# EAGLE design Daughter Board_2.1 (EAGLE 9.6.2)
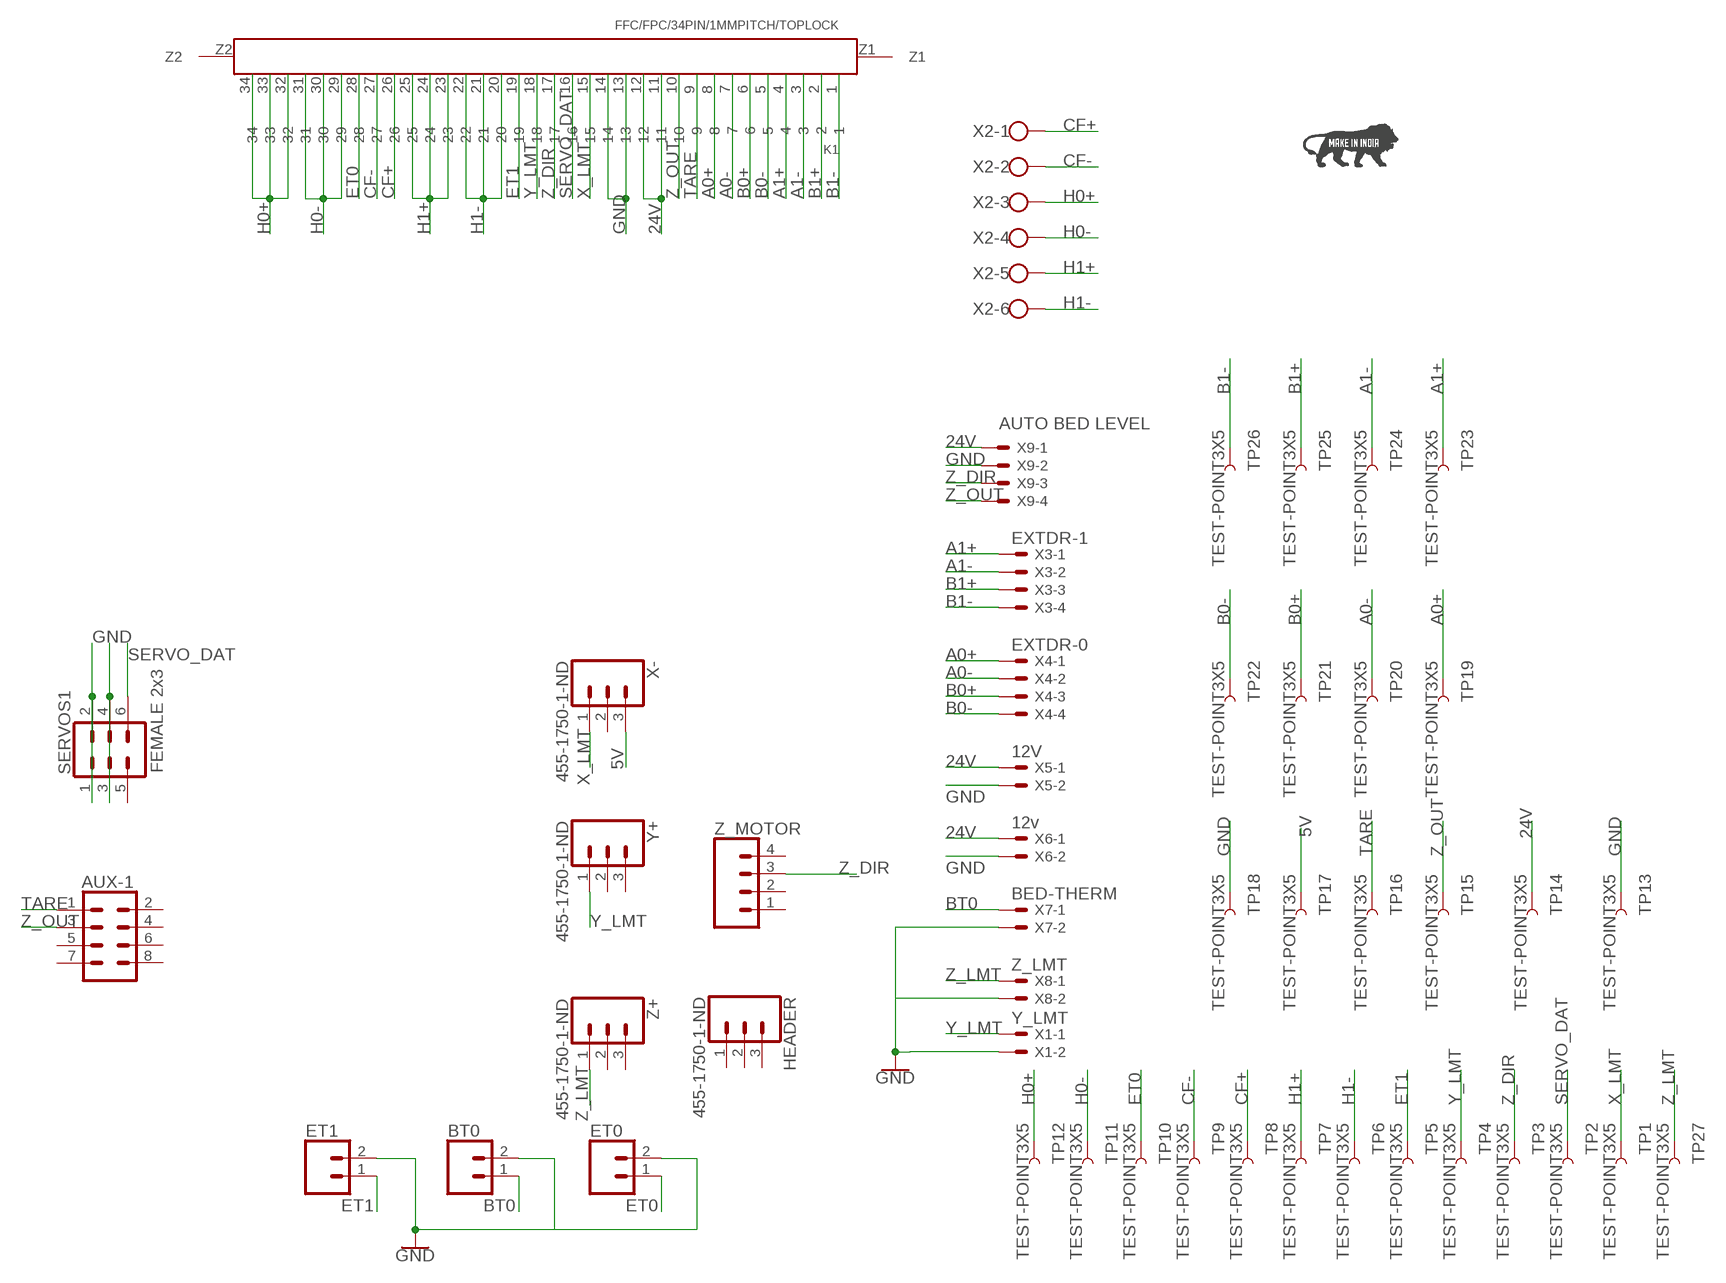
[diagram p0: schematic, sheet 1]

## Parts
AUX-1  CONN_04X2  [2X4]
BT0  CONN_02  [1X02]
ET0  CONN_02  [1X02]
ET1  CONN_02  [1X02]
HEADER  455-1750-1-ND  CONN_03  [1X03]
K1  FFC/FPC/34PIN/1MMPITCH/TOPLOCK  [34PIN/1MMPITCH/FFC/FPC]
SERVOS1  FEMALE 2x3  CONN_03X2FEMALE  [2X3]
TP1  TEST-POINT3X5  [PAD.03X.05]
TP2  TEST-POINT3X5  [PAD.03X.05]
TP3  TEST-POINT3X5  [PAD.03X.05]
TP4  TEST-POINT3X5  [PAD.03X.05]
TP5  TEST-POINT3X5  [PAD.03X.05]
TP6  TEST-POINT3X5  [PAD.03X.05]
TP7  TEST-POINT3X5  [PAD.03X.05]
TP8  TEST-POINT3X5  [PAD.03X.05]
TP9  TEST-POINT3X5  [PAD.03X.05]
TP10  TEST-POINT3X5  [PAD.03X.05]
TP11  TEST-POINT3X5  [PAD.03X.05]
TP12  TEST-POINT3X5  [PAD.03X.05]
TP13  TEST-POINT3X5  [PAD.03X.05]
TP14  TEST-POINT3X5  [PAD.03X.05]
TP15  TEST-POINT3X5  [PAD.03X.05]
TP16  TEST-POINT3X5  [PAD.03X.05]
TP17  TEST-POINT3X5  [PAD.03X.05]
TP18  TEST-POINT3X5  [PAD.03X.05]
TP19  TEST-POINT3X5  [PAD.03X.05]
TP20  TEST-POINT3X5  [PAD.03X.05]
TP21  TEST-POINT3X5  [PAD.03X.05]
TP22  TEST-POINT3X5  [PAD.03X.05]
TP23  TEST-POINT3X5  [PAD.03X.05]
TP24  TEST-POINT3X5  [PAD.03X.05]
TP25  TEST-POINT3X5  [PAD.03X.05]
TP26  TEST-POINT3X5  [PAD.03X.05]
TP27  TEST-POINT3X5  [PAD.03X.05]
U$2  MAKEININDIA  [MAKEININDIA]
X1  Y_LMT  JST-XH-02-PIN-LONG-PAD  [JST-XH-02-PACKAGE-LONG-PAD]
X2  W237-6  [W237-6]
X3  EXTDR-1  JST-XH-04-PIN-LONG-PAD  [JST-XH-04-PACKAGE-LONG-PAD]
X4  EXTDR-0  JST-XH-04-PIN-LONG-PAD  [JST-XH-04-PACKAGE-LONG-PAD]
X5  12V  JST-XH-02-PIN-LONG-PAD  [JST-XH-02-PACKAGE-LONG-PAD]
X6  12v  JST-XH-02-PIN-LONG-PAD  [JST-XH-02-PACKAGE-LONG-PAD]
X7  BED-THERM  JST-XH-02-PIN-LONG-PAD  [JST-XH-02-PACKAGE-LONG-PAD]
X8  Z_LMT  JST-XH-02-PIN-LONG-PAD  [JST-XH-02-PACKAGE-LONG-PAD]
X9  JST-XH-04-PIN-LONG-PAD  [JST-XH-04-PACKAGE-LONG-PAD]
X-  455-1750-1-ND  CONN_03  [1X03]
Y+  455-1750-1-ND  CONN_03  [1X03]
Z+  455-1750-1-ND  CONN_03  [1X03]
Z_MOTOR  CONN_04  [1X04]

## Nets
5V: TP17.P$1 X-.3
24V: K1.11 K1.12 TP14.P$1 X5.1 X6.1 X9.1
A0+: K1.8 TP19.P$1 X4.1
A0-: K1.7 TP20.P$1 X4.2
A1+: K1.4 TP23.P$1 X3.1
A1-: K1.3 TP24.P$1 X3.2
B0+: K1.6 TP21.P$1 X4.3
B0-: K1.5 TP22.P$1 X4.4
B1+: K1.2 TP25.P$1 X3.3
B1-: K1.1 TP26.P$1 X3.4
BT0: BT0.1 X7.1
CF+: K1.26 TP8.P$1 X2.1
CF-: K1.27 TP9.P$1 X2.2
ET0: ET0.1 K1.28 TP10.P$1
ET1: ET1.1 K1.19 TP5.P$1
GND: BT0.2 ET0.2 ET1.2 K1.13 K1.14 SERVOS1.1 SERVOS1.2 TP13.P$1 TP18.P$1 X1.2 X5.2 X6.2 X7.2 X8.2 X9.2
H0+: K1.32 K1.33 K1.34 TP12.P$1 X2.3
H0-: K1.29 K1.30 K1.31 TP11.P$1 X2.4
H1+: K1.23 K1.24 K1.25 TP7.P$1 X2.5
H1-: K1.20 K1.21 K1.22 TP6.P$1 X2.6
N$1: SERVOS1.3 SERVOS1.4
SERVO_DAT: K1.16 SERVOS1.6 TP2.P$1
TARE: AUX-1.1 K1.9 TP16.P$1
X_LMT: K1.15 TP1.P$1 X-.1
Y_LMT: K1.18 TP4.P$1 X1.1 Y+.1
Z_DIR: K1.17 TP3.P$1 X9.3 Z_MOTOR.3
Z_LMT: TP27.P$1 X8.1 Z+.1
Z_OUT: AUX-1.3 K1.10 TP15.P$1 X9.4
Unconnected: AUX-1.2 AUX-1.4 AUX-1.5 AUX-1.6 AUX-1.7 AUX-1.8 HEADER.1 HEADER.2 HEADER.3 K1.Z1 K1.Z2 SERVOS1.5 X-.2 Y+.2 Y+.3 Z+.2 Z+.3 Z_MOTOR.1 Z_MOTOR.2 Z_MOTOR.4

## Library data of the parts
AUX-1 = SparkFun-Connectors:CONN_04X2: Multi connection point. Often used as Generic Header-pin footprint for 0.1 inch spaced/style header connections On any of the 0.1 inch spaced packages, you can populate with these: Break Away Headers - Straight <https://www.sparkfun.com/products/116> (PRT-00116) Break Away Male Headers - Right Angle <https://www.sparkfun.com/products/553> (PRT-00553) Female Headers <https://www.sparkfun.com/products/115> (PRT-00115) Break Away Headers - Machine Pin <https://www.sparkfun.com/products/117> (PRT-00117) Break Away Female Headers - Swiss Machine Pin <https://www.sparkfun.com/products/743> (PRT-00743)
BT0 ET0 ET1 = SparkFun-Connectors:CONN_02: Multi connection point. Often used as Generic Header-pin footprint for 0.1 inch spaced/style header connections On any of the 0.1 inch spaced packages, you can populate with these: Break Away Headers - Straight <https://www.sparkfun.com/products/116> (PRT-00116) Break Away Male Headers - Right Angle <https://www.sparkfun.com/products/553> (PRT-00553) Female Headers <https://www.sparkfun.com/products/115> (PRT-00115) Break Away Headers - Machine Pin <https://www.sparkfun.com/products/117> (PRT-00117) Break Away Female Headers - Swiss Machine Pin <https://www.sparkfun.com/products/743> (PRT-00743) For SCREWTERMINALS and SPRING TERMINALS visit here: Screw Terimnals on SparkFun.com <https://www.sparkfun.com/search/results?term=Screw+Terminals> (5mm/3.5mm/2.54mm spacing) This device is also useful as a general connection point to wire up your design to another part of your project. Our various solder wires solder well into these plated through hole pads. Hook-Up Wire - Assortment (Stranded, 22 AWG) <https://www.sparkfun.com/products/11375> (PRT-11375) Hook-Up Wire - Assortment (Solid Core, 22 AWG) <https://www.sparkfun.com/products/11367> (PRT-11367) View the entire wire category on our website here <https://www.sparkfun.com/categories/141> Special notes: Molex polarized connector foot print use with: PRT-08233 with associated crimp pins and housings. 2.54_SCREWTERM for use with PRT-10571. 3.5mm Screw Terminal footprints for PRT-08084 5mm Screw Terminal footprints for use with PRT-08432
HEADER X- Y+ Z+ = SparkFun-Connectors:CONN_03: Multi connection point. Often used as Generic Header-pin footprint for 0.1 inch spaced/style header connections On any of the 0.1 inch spaced packages, you can populate with these: Break Away Headers - Straight <https://www.sparkfun.com/products/116> (PRT-00116) Break Away Male Headers - Right Angle <https://www.sparkfun.com/products/553> (PRT-00553) Female Headers <https://www.sparkfun.com/products/115> (PRT-00115) Break Away Headers - Machine Pin <https://www.sparkfun.com/products/117> (PRT-00117) Break Away Female Headers - Swiss Machine Pin <https://www.sparkfun.com/products/743> (PRT-00743) Stackable Header - 3 Pin (Female, 0.1") <https://www.sparkfun.com/products/13875> (PRT-13875) For SCREWTERMINALS and SPRING TERMINALS visit here: Screw Terimnals on SparkFun.com <https://www.sparkfun.com/search/results?term=Screw+Terminals> (5mm/3.5mm/2.54mm spacing) This device is also useful as a general connection point to wire up your design to another part of your project. Our various solder wires solder well into these plated through hole pads. Hook-Up Wire - Assortment (Stranded, 22 AWG) <https://www.sparkfun.com/products/11375> (PRT-11375) Hook-Up Wire - Assortment (Solid Core, 22 AWG) <https://www.sparkfun.com/products/11367> (PRT-11367) View the entire wire category on our website here <https://www.sparkfun.com/categories/141> Special notes: Molex polarized connector foot print use with SKU : PRT-08232 with associated crimp pins and housings.; PROD_ID: XXX-00000
K1 = FracktalWorks_Eagle_Library:FFC/FPC/34PIN/1MMPITCH/TOPLOCK
SERVOS1 = SparkFun-Connectors:CONN_03X2: Multi connection point. Often used as Generic Header-pin footprint for 0.1 inch spaced/style header connections You can populate with any combo of single row headers, but if you'd like an exact match, check these: Header - 2x3 (Male, 0.1") <https://www.sparkfun.com/products/12807> (PRT-12807) Header - 2x3 (Female, 0.1") <https://www.sparkfun.com/products/13010> (PRT-13010) 2x3 Pin Shrouded Header <https://www.sparkfun.com/products/10877> (PRT-10877) On any of the 0.1 inch spaced packages, you can populate with these: Break Away Headers - Straight <https://www.sparkfun.com/products/116> (PRT-00116) Break Away Male Headers - Right Angle <https://www.sparkfun.com/products/553> (PRT-00553) Female Headers <https://www.sparkfun.com/products/115> (PRT-00115) Break Away Headers - Machine Pin <https://www.sparkfun.com/products/117> (PRT-00117) Break Away Female Headers - Swiss Machine Pin <https://www.sparkfun.com/products/743> (PRT-00743) Special note: the shrouded connector mates well with our 3x2 ribbon cables: Ribbon Crimp Connector - 6-pin (2x3, Female) <https://www.sparkfun.com/products/10651> (PRT-10651) Ribbon Cable - 6 wire (15ft) <https://www.sparkfun.com/products/10646> (PRT-10646); PROD_ID: CONN-11566
TP1-TP27 = SparkFun-Connectors:TEST-POINT: SparkFun Test Points Bare copper test points for troubleshooting or In-Circuit-Testing. These are used by our Production team for verifying production board runs using pogo-pins on test beds. SparkFun Products: SparkFun LSM9DS1 Breakout <https://www.sparkfun.com/products/13284> SparkFun PSOC <https://www.sparkfun.com/products/13714> SparkFun Load Cell Amplifier <https://www.sparkfun.com/products/13879>
U$2 = FracktalWorks_Eagle_Library:MAKEININDIA
X1 X5-X8 = Rembrandt Electronics - JST XH Connectors v1-0:JST-XH-02-PIN: JST XH Connector 2 Pin Wire to board connector. Pitch: 2,54 mm, (0.100") Number of pins: 2 Created by Rembrandt Electronics www.rembrandtelectronics.com
X2 = con-wago-500:W237-6: WAGO SCREW CLAMP; OC_FARNELL: unknown; OC_NEWARK: unknown
X3 X4 = Rembrandt Electronics - JST XH Connectors v1-0:JST-XH-04-PIN: JST XH Connector 2 Pin Wire to board connector. Pitch: 2,54 mm, (0.100") Number of pins: 4 Created by Rembrandt Electronics www.rembrandtelectronics.com
X9 = Rembrandt Electronics - JST XH Connectors v1-0:JST-XH-04-PIN: JST XH Connector 2 Pin Wire to board connector. Pitch: 2,54 mm, (0.100") Number of pins: 4 Created by Rembrandt Electronics www.rembrandtelectronics.com; AUTOBEDLEVL: AUTO BED LEVEL
Z_MOTOR = SparkFun-Connectors:CONN_04: Multi connection point. Often used as Generic Header-pin footprint for 0.1 inch spaced/style header connections On any of the 0.1 inch spaced packages, you can populate with these: Break Away Headers - Straight <https://www.sparkfun.com/products/116> (PRT-00116) Break Away Male Headers - Right Angle <https://www.sparkfun.com/products/553> (PRT-00553) Female Headers <https://www.sparkfun.com/products/115> (PRT-00115) Break Away Headers - Machine Pin <https://www.sparkfun.com/products/117> (PRT-00117) Break Away Female Headers - Swiss Machine Pin <https://www.sparkfun.com/products/743> (PRT-00743) For SCREWTERMINALS and SPRING TERMINALS visit here: Screw Terimnals on SparkFun.com <https://www.sparkfun.com/search/results?term=Screw+Terminals> (5mm/3.5mm/2.54mm spacing) This device is also useful as a general connection point to wire up your design to another part of your project. Our various solder wires solder well into these plated through hole pads. Hook-Up Wire - Assortment (Stranded, 22 AWG) <https://www.sparkfun.com/products/11375> (PRT-11375) Hook-Up Wire - Assortment (Solid Core, 22 AWG) <https://www.sparkfun.com/products/11367> (PRT-11367) View the entire wire category on our website here <https://www.sparkfun.com/categories/141> Special notes: Molex polarized connector foot print use with SKU : PRT-08231 with associated crimp pins and housings. 1MM SMD Version SKU: PRT-10208; PROD_ID: CONN-09696

## Board
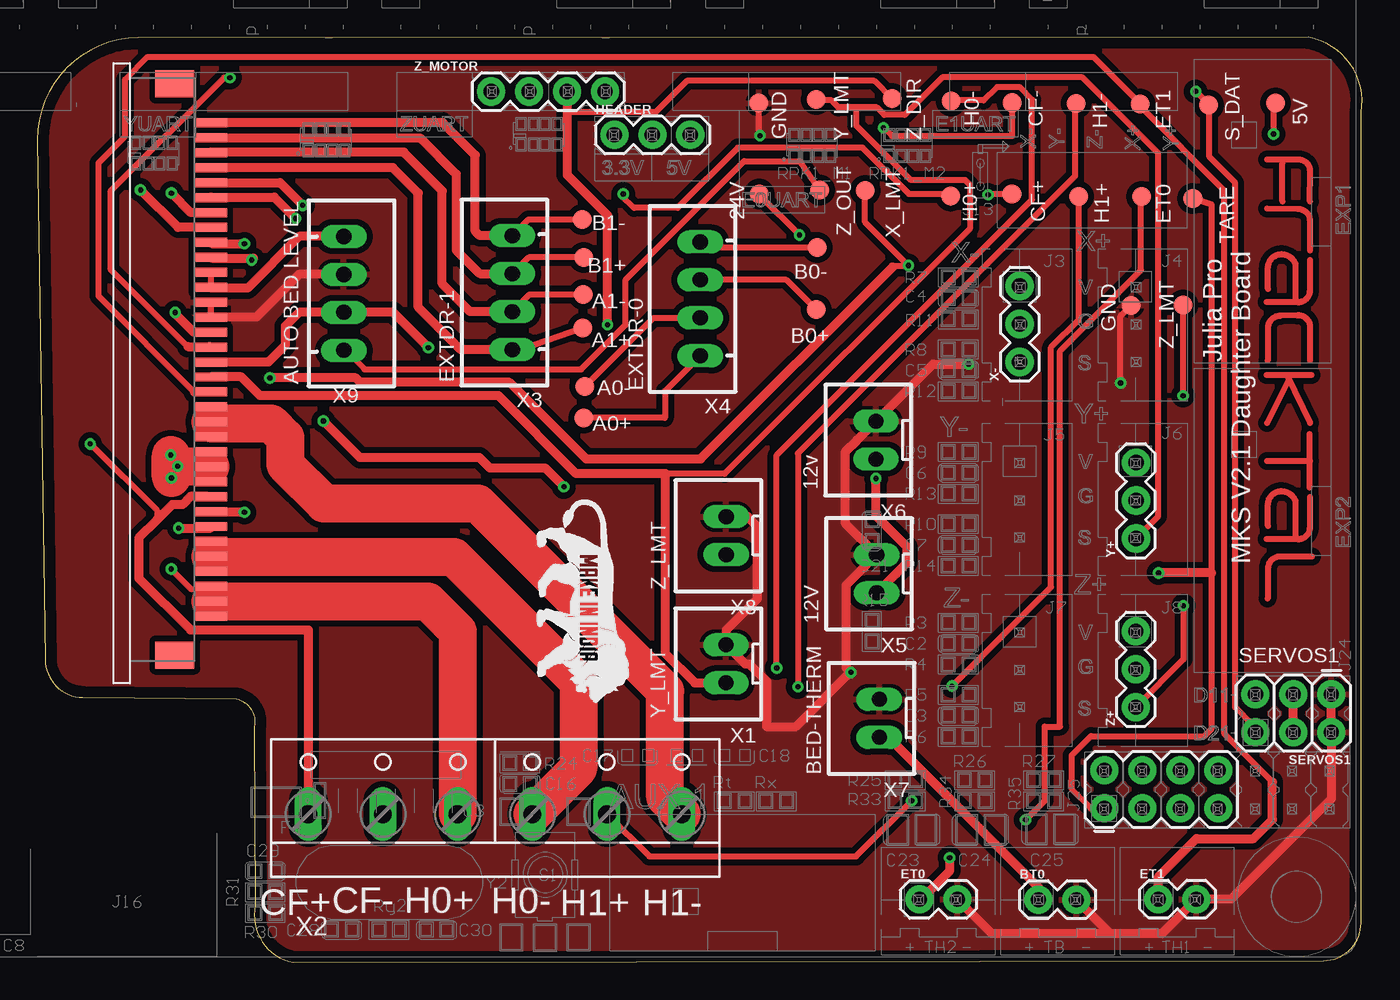
[diagram p1: board, top side]
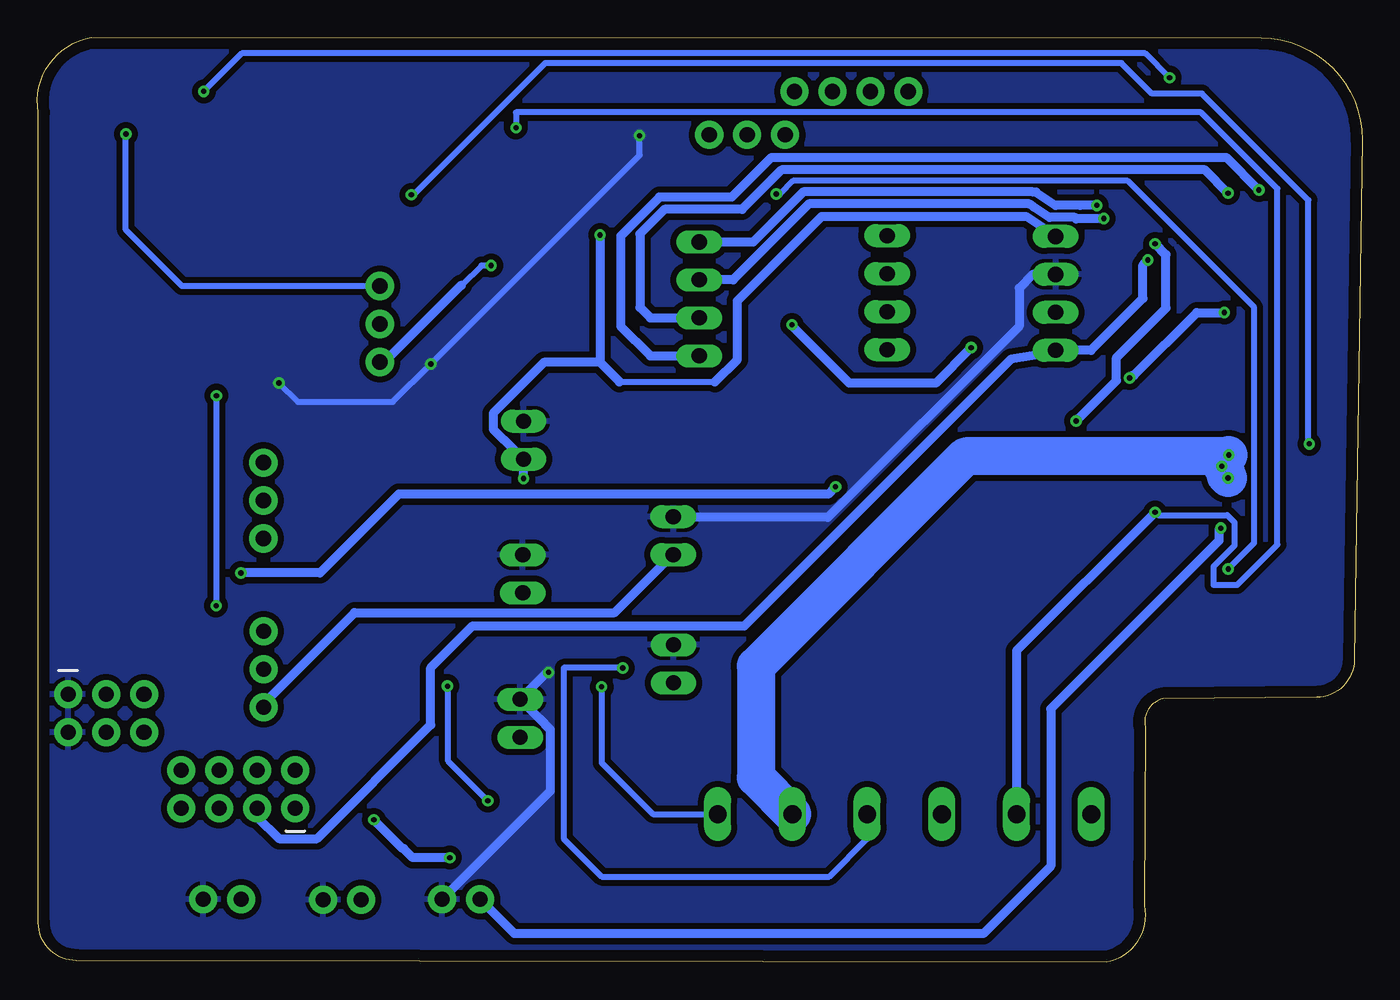
[diagram p2: board, bottom side, seen from below]

Size 88.64 x 61.87 mm. Coordinates in mm from the lower left corner, seen from the top.
Outline: 88.57,2.66 88.58,56.83 arc90 85.02,61.87 6.76,61.83 arc90 0,55.01 0.52,20.26 arc89 3.04,17.72 13.33,17.62 arc-89 14.52,15.78 14.57,3.8 arc90 17.11,0 86.03,0.12 arc90 88.57,2.66
Copper layers (1*16): Top 0.035mm / dielectric 1.5mm / Bottom 0.035mm
Design rules "LionCircuits": minimum track width 8mil, minimum drill 0.35mm, track to track 8mil, track to pad 8mil, pad to pad 8mil, via to via 8mil, smd to smd 8mil, copper to edge 30mil, drill to drill 10mil, minimum pad ring 10mil, minimum via ring 8mil, stop-mask expansion 4mil, vias tented up to drill 0mil, thermal gap 10mil

### Footprints (pad centres in the part's own frame; a part is rotated, then mirrored left to right if it is on the bottom)
2X4 = drill 1.016 pad 1.88: 1 -3.81,-1.27; 2 -3.81,1.27; 3 -1.27,-1.27; 4 -1.27,1.27; 5 1.27,-1.27; 6 1.27,1.27; 7 3.81,-1.27; 8 3.81,1.27
1X02 = drill 1.016 pad 1.88: 1 0,0; 2 2.54,0
1X03 = drill 1.016 pad 1.88: 1 0,0; 2 2.54,0; 3 5.08,0
34PIN/1MMPITCH/FFC/FPC = smd 0.6 x 2.2: 1 -14.43,2.1; 2 -13.43,2.1; 3 -12.43,2.1; 4 -11.43,2.1; 5 -10.43,2.1; 6 -9.43,2.1; 7 -8.43,2.1; 8 -7.43,2.1; 9 -6.43,2.1; 10 -5.43,2.1; 11 -4.43,2.1; 12 -3.43,2.1; 13 -2.43,2.1; 14 -1.43,2.1; 15 -0.43,2.1; 16 0.57,2.1; 17 1.57,2.1; 18 2.57,2.1; 19 3.57,2.1; 20 4.57,2.1; 21 5.57,2.1; 22 6.57,2.1; 23 7.57,2.1; 24 8.57,2.1; 25 9.57,2.1; 26 10.57,2.1; 27 11.57,2.1; 28 12.57,2.1; 29 13.57,2.1; 30 14.57,2.1; 31 15.57,2.1; 32 16.57,2.1; 33 17.57,2.1; 34 18.57,2.1 | smd 1.8 x 2.6: Z1 -17.03,-0.3; Z2 21.17,-0.3
2X3 = drill 1.016 pad 1.88: 1 0,0; 2 0,2.54; 3 2.54,0; 4 2.54,2.54; 5 5.08,0; 6 5.08,2.54
PAD.03X.05 = smd 1.27 x 1.27: P$1 0,0
JST-XH-02-PACKAGE-LONG-PAD = drill 1.016 long: 1 -1.27,0; 2 1.27,0
W237-6 = drill 1.194 long: 1 -12.5,-1.27; 2 -7.5,-1.27; 3 -2.5,-1.27; 4 2.5,-1.27; 5 7.5,-1.27; 6 12.5,-1.27
JST-XH-04-PACKAGE-LONG-PAD = drill 1.016 long: 1 -3.81,0; 2 -1.27,0; 3 1.27,0; 4 3.81,0
1X04 = drill 1.016 pad 1.88: 1 0,0; 2 2.54,0; 3 5.08,0; 4 7.62,0

### Placement (x,y rotation side)
AUX-1  75.19,11.58 0 top
BT0  66.98,4.19 0 top
ET0  59.01,4.21 0 top
ET1  75,4.23 0 top
HEADER  38.61,55.34 0 top
K1  9.49,41.72 270 top
SERVOS1  86.58,17.92 180 top
TP1  55.38,51.61 180 top
TP2  78.37,57.36 180 top
TP3  57.19,57.76 180 top
TP4  52.12,57.7 180 top
TP5  73.79,57.42 180 top
TP6  69.5,57.45 180 top
TP7  69.67,51.22 180 top
TP8  65.2,51.38 180 top
TP9  65.22,57.49 180 top
TP10  73.88,51.23 180 top
TP11  61.14,57.62 180 top
TP12  61.11,51.24 180 top
TP13  48.26,57.47 180 top
TP14  48.31,51.38 180 top
TP15  52.33,51.65 180 top
TP16  77.31,51.1 180 top
TP17  82.85,57.48 180 top
TP18  73.19,43.94 180 top
TP19  36.57,36.41 180 top
TP20  36.62,38.51 180 top
TP21  52.1,43.67 180 top
TP22  52.18,47.8 180 top
TP23  36.48,42.44 180 top
TP24  36.52,44.65 180 top
TP25  36.57,47.16 180 top
TP26  36.47,49.67 180 top
TP27  76.67,43.96 180 top
U$1  [FRACKTALLOGO]  82.16,41.7 270 top
U$2  32.7,29.97 270 top
X1  46.08,19.96 90 top
X2  30.62,11.19 0 top
X3  31.77,44.79 90 top
X4  44.35,44.38 90 top
X5  56.16,25.99 90 top
X6  56.11,34.93 90 top
X7  56.33,16.32 90 top
X8  46.09,28.54 90 top
X9  20.51,44.74 270 top
X-  65.72,40.16 90 top
Y+  73.51,28.35 90 top
Z+  73.49,17.07 90 top
Z_MOTOR  30.37,58.24 0 top

### Tracks (layer width: path | path; a pad name or v marks a point on that pad's centre or on a via)
5V  (via drill 0.35)
  Top 0.203: 82.71,57.34 TP17.P$1
  Top 0.406: v82.71,55.4 82.71,57.34
  Bottom 0.406: X-.3 78.96,45.24 82.71,48.99 v82.71,55.4
24V  (via drill 0.35)
  Top 0.406: K1.11 K1.12 | v50.99,48.66 48.39,51.25 TP14.P$1
  Top 0.61: X9.1 17.51,48.55 14.05,45.1 11.65,45.1 K1.12 | X5.1 57.43,25.99 57.45,25.99 58.19,26.73 58.19,27.79 56.11,29.86 v56.11,32.37
  Bottom 0.406: 49.69,38.82 43.3,38.82
  Bottom 0.61: 43.3,38.82 41.8,40.32 41.8,44.25 36.15,49.9 22.5,49.9 X9.1 | v50.99,48.66 50.99,40.12 | 49.69,38.82 50.99,40.12 | X6.1 57.38,34.93 57.4,34.93 58.14,35.67 58.14,36.72 54.74,40.12 50.99,40.12 | X6.1 56.13,33.64 | v56.11,32.37 X6.1
A0+  (via drill 0.35)
  Top 0.406: X4.1 41.99,38.21 41.99,36.41 TP19.P$1
  Top 0.61: K1.8 9.41,49.15 v6.91,51.66
  Bottom 0.61: X4.1 47.62,40.57 49.61,42.56 49.61,48.58 47.02,51.18 42.19,51.18 39.52,53.84 9.09,53.84 v6.91,51.66
A0-  (via drill 0.35)
  Top 0.406: TP20.P$1 41.22,43.11 X4.2
  Top 0.61: K1.7 10.27,50.15 v8.97,51.45
  Bottom 0.61: v8.97,51.45 10.52,53 38.84,53 41.48,50.36 46.68,50.36 48.32,48.72 48.32,43.81 47.62,43.11 X4.2
A1+
  Top 0.406: TP23.P$1 32.43,41.04 31.94,41.04 X3.1
  Top 0.61: X3.1 28.33,40.98 25.48,43.83 25.48,51.45 23.78,53.15 K1.4
A1-
  Top 0.406: TP24.P$1 32.91,44.66 X3.2
  Top 0.61: X3.2 28.96,43.52 27.09,45.39 27.09,51.6 24.51,54.19 11.63,54.19 K1.3
B0+  (via drill 0.35)
  Top 0.406: TP21.P$1 50.13,45.65 X4.3
  Top 0.61: K1.6 11.62,51.18 15.85,51.18 v17.28,49.75
  Bottom 0.61: X4.3 42.09,45.65 37.01,50.72 22.27,50.72 | v17.28,49.75 17.3,49.73 19.12,49.73 19.22,49.82 20.92,49.82 21.97,50.53 21.98,50.53 22.27,50.72 | 22.27,50.72
B0-  (via drill 0.35)
  Top 0.406: TP22.P$1 44.74,47.8 X4.4
  Top 0.61: K1.5 16.23,52.15 v17.75,50.63
  Bottom 0.61: X4.4 40.73,48.19 37.38,51.54 22.02,51.54 | v17.75,50.63 18.88,50.63 18.88,50.64 20.51,50.64 21.83,51.52 22,51.52 22.02,51.54 | 22.02,51.54
B1+
  Top 0.406: TP25.P$1 32.87,47.16 X3.3
  Top 0.61: X3.3 29.6,46.06 28.02,47.64 28.02,52.72 25.6,55.14 11.61,55.14 K1.2
B1-
  Top 0.406: TP26.P$1 32.84,49.67 X3.4
  Top 0.61: X3.4 29.6,48.6 29.29,48.91 29.29,53.99 27.12,56.17 11.61,56.17 K1.1
BT0
  Top 0.61: BT0.1 66.98,5.02 56.95,15.05 X7.1
CF+  (via drill 0.35)
  Top 0.406: v63.62,51.34 63.66,51.38 TP8.P$1 | v3.54,34.68 3.55,34.66 3.57,34.66 8.01,30.23 8.01,29.61
  Top 0.61: K1.26 11.41,31.15 11.4,31.16 10.25,31.16 9.71,30.62 9.02,30.62 8.01,29.61 6.79,28.39 6.79,25.69 10.24,22.24 18.12,22.24 X2.1
  Bottom 0.406: v63.62,51.34 63.5,51.46 63.35,51.46 54.65,60.15 16.1,60.15 14.06,58.11 10.72,58.11 3.59,50.98 3.59,34.74 v3.54,34.68
CF-  (via drill 0.35)
  Top 0.406: v56.61,55.83 57.16,55.27 65.22,55.27 TP9.P$1
  Top 0.61: K1.27 13.8,30.15 v13.85,30.1
  Bottom 0.406: v56.61,55.83 56.61,56.86 10.78,56.86 5.67,51.75 5.67,27.93 8.36,25.24 9.94,25.24 9.94,26.46 8.54,27.86 8.54,29.43 9.03,29.91 13.65,29.91 v13.85,30.1
  Bottom 0.61: v13.85,30.1 23.12,20.83 X2.2
ET0  (via drill 0.35)
  Top 0.406: TP10.P$1 73.85,51.09 73.85,46.3 68.43,40.88 68.43,15.76 67.39,15.76 67.39,10.81 v66.12,9.54 | 59.4,4.49 ET0.1
  Top 0.61: K1.28 11.59,29.04 v9.46,29.04 | 59.4,4.49 61.04,6.13 v61.04,7
  Bottom 0.61: v9.46,29.04 9.56,28.94 9.56,28.22 20.83,16.95 20.83,6.44 25.35,1.92 56.72,1.92 ET0.1 | v61.04,7 63.52,7 64.13,7.61 64.19,7.61 v66.12,9.54
ET1
  Top 0.406: 10.51,38.14 4.08,44.57 4.08,53.46 5.88,55.26 5.88,59.04 7.39,60.56 70.66,60.56 TP5.P$1 73.79,57.25 79.38,51.65 79.38,15.33 82.63,12.08
  Top 0.61: 82.63,12.08 82.63,9.54 81.36,8.27 77.55,8.27 75,5.72 ET1.1 | K1.19 11.58,38.14 10.51,38.14
GND  (via drill 0.35)
  Top 0.406: K1.13 K1.14 | v48.34,55.29 48.26,55.37 TP13.P$1 | v72.47,38.75 72.47,43.23 TP18.P$1
  Top 0.61: BT0.2 71.79,1.92 | 71.79,1.92 75.24,1.92 ET1.2 79.86,4.23 86.58,10.95 SERVOS1.2 SERVOS1.1 | 71.79,1.92 63.85,1.92 ET0.2 | X9.2 17.51,46.01 14.65,43.15 K1.14 | v62.31,40.02 59.93,40.02 X6.2 54.84,34.93 54.82,34.93 54.08,34.18 54.08,29.34 X5.2 56.14,27.26 54.13,25.24 54.13,19.7 v54.43,19.39 54.38,19.39 50.75,15.77 48.79,15.77 48.79,18.79 47.62,19.96 47.35,19.96 X1.2 46.08,22.23 48.15,24.3 48.15,29.18 47.53,29.8 X8.2
  Bottom 0.406: v48.34,55.29 48.34,53.99 v62.31,40.02 64.85,37.48 71.2,37.48 v72.47,38.75
  Bottom 0.61: X9.2 22.03,46.01 22.94,45.1 22.94,42.56 35.74,29.76 46.05,29.76 X8.2 | ET0.2 54.3,11.47 54.3,15.57 55.04,16.32 55.06,16.32 X7.2 54.53,19.39 v54.43,19.39
  pour Bottom (isolate 0.406): 88.55,4.87 arc-90 83.69,0 16.27,0 arc-90 14,2.27 14,16.88 arc90 13.08,17.8 1.35,17.8 arc-90 0.32,18.83 0.32,56.59 arc-90 5.4,61.67 85.15,61.67 arc-90 88.55,58.27 88.55,4.85
  pour Top (isolate 0.406): 85,61.86 6.83,61.86 arc90 0.52,55.54 0.52,20.38 arc90 3.18,17.72 13.18,17.72 arc-90 14.56,16.34 14.56,3.64 arc90 18.16,0.04 85.66,0.04 arc90 88.63,3.01 88.63,58.23 arc90
H0+  (via drill 0.35)
  Top 0.406: K1.34 K1.33 K1.32 10.29,24.97 8.96,26.29 v8.96,26.31 | TP12.P$1 60.67,51.4 58.3,51.4 55.21,54.49 46.87,54.49 42.84,50.46 39.93,50.46 39.1,51.29 v39.2,51.39
  Top 2.54: K1.33 26.11,24.15 28.12,22.14 X2.3
  Bottom 0.406: v8.96,26.31 7.22,28.05 7.22,43.8 15.68,52.27 38.07,52.27 38.95,51.39 v39.2,51.39
H0-  (via drill 0.35)
  Top 0.406: K1.31 K1.30 K1.29 | v49.46,19.69 49.46,33.92 66.55,51.01 66.55,57.71 65.72,58.54 64.2,58.54 63.31,57.65 61.2,57.65 TP11.P$1
  Top 2.54: K1.30 11.62,27.12 27.86,27.12 36.2,18.78 36.2,12.99 X2.4
  Bottom 0.406: v49.46,19.69 49.61,19.69 49.61,19.7 53.42,19.7 53.42,8.27 50.88,5.73 35.64,5.73 33.12,8.25 X2.4
H1+  (via drill 0.35)
  Top 0.406: TP7.P$1 69.67,51.14 69.67,51.13 69.67,42.99 67.82,41.14 67.82,25.1 v61.2,18.48 v61.19,18.48 61.14,18.52 | K1.25 K1.24 K1.23 | X2.5 40.95,7.08 54.78,7.08 v58.5,10.81
  Top 2.54: K1.24 9.41,33.15 v9.39,33.18 | v8.97,32.4 8.92,32.45 v8.92,33.93
  Bottom 0.406: v58.5,10.81 61.16,13.46 61.16,18.43 v61.2,18.48
  Bottom 2.54: X2.5 40.57,12.37 40.57,19.81 26.54,33.85 9.01,33.85 v8.92,33.93 | v9.39,33.18 9.15,32.94 9.15,32.57 v8.97,32.4
H1-  (via drill 0.35)
  Top 0.406: K1.22 K1.21 K1.20 | TP6.P$1 69.43,57.34 69.43,52.58 50.88,34.04 v50.88,18.43
  Top 2.54: K1.21 11.69,36.05 15.64,36.05 16.59,35.1 16.59,33.29 19.18,30.71 29.46,30.71 42.01,18.16 42.01,11.03 X2.6
  Bottom 0.406: v50.88,18.43 50.88,13.35 47.45,9.92 X2.6
N$1
  Top 0.61: SERVOS1.4 SERVOS1.3
SERVO_DAT  (via drill 0.35)
  Top 0.406: SERVOS1.6 81.34,15.87 80.15,17.05 80.15,52.14 78.42,53.87 78.42,57.34 TP2.P$1 78.27,57.49 v77.5,58.26 | 10.06,41.19 4.88,46.37 4.88,51.56 12.49,59.17 v12.89,59.17
  Top 0.61: 10.06,41.19 11.51,41.19 K1.16
  Bottom 0.406: v12.89,59.17 14.51,60.8 74.96,60.8 v77.5,58.26
TARE  (via drill 0.35)
  Top 0.406: TP16.P$1 78.57,50.68 78.57,26.05 78.57,15.63 78.07,15.13 70.5,15.13 69.2,13.83 69.2,11.59 70.48,10.31 AUX-1.1
  Top 0.61: K1.9 11.68,48.07 12.05,48.07 12.06,48.06 v13.85,48.06 | 78.57,26.05 v75.01,26.05 | v35.23,31.8 33.96,33.08 30.27,33.08 29.59,33.75 21.59,33.75 v19.13,36.21
  Bottom 0.61: v35.23,31.8 35.72,31.32 64.45,31.32 69.72,26.05 v75.01,26.05 | v19.13,36.21 16.44,38.9 16.44,40.45 13.13,43.76 13.13,47.34 v13.85,48.06
X_LMT  (via drill 0.35)
  Top 0.406: 57.21,46.5 57.23,46.52 57.15,46.61 v58.28,46.61 55.38,49.51 TP1.P$1
  Top 0.61: v9.22,43.46 9.22,43.38 10.44,42.15 K1.15 | v15.56,39.09 21.31,39.09 21.6,38.79 31.59,38.79 36.71,33.67 44.38,33.67 57.21,46.5
  Bottom 0.406: v58.28,46.61 58.93,46.61 60.25,45.28
  Bottom 0.61: 60.25,45.28 60.3,45.28 65.06,40.52 X-.1 | v9.22,43.46 11.07,43.46 15.27,39.26 15.38,39.26 v15.56,39.09
Y_LMT
  Top 0.406: 54.8,57.19 56.16,57.19 56.67,56.68 58.03,56.68 60.54,59.19 69.92,59.19 74.99,54.12 74.99,29.83 Y+.1 | 54.8,57.19 53.6,57.19 53.14,57.65 52.2,57.65 TP4.P$1 | 54.8,57.19 54.8,55.97 58.45,52.31 62.08,52.31 62.41,51.98 62.41,49.1 45.98,32.66 42.02,32.66 42,32.69
  Top 0.61: K1.18 13.65,39.15 14.9,37.9 30.85,37.9 36.06,32.69 42,32.69 42,20.68 43.99,18.69 X1.1
Z_DIR  (via drill 0.35)
  Top 0.406: TP3.P$1 56,58.96 43.46,58.96 41.35,56.85 35.47,56.85
  Top 0.61: K1.17 15.46,40.15 16.59,41.29 16.59,42.56 17.51,43.47 X9.3 20.81,43.47 23.81,43.47 v26.17,41.12 | v38.15,42.65 38.15,49.97 35.45,52.67 Z_MOTOR.3
  Bottom 0.61: v26.17,41.12 28.53,38.75 34.3,38.75 38.15,42.59 v38.15,42.65
Z_LMT  (via drill 0.35)
  Top 0.406: v76.66,37.9 76.66,43.94 TP27.P$1 | v76.68,23.85 76.68,20.26 Z+.1
  Bottom 0.406: 73.44,17.36 Z+.1 | v76.66,37.9 76.66,23.87 v76.68,23.85
  Bottom 0.61: X8.1 46.14,27.26 50.02,23.39 67.41,23.39 73.44,17.36
Z_OUT  (via drill 0.35)
  Top 0.406: TP15.P$1 51.01,53.58 47.29,53.58 39.37,45.66 39.37,42.64 36.39,39.66 21.88,39.66 20.66,40.88 X9.4
  Top 0.61: K1.10 11.65,47.1 14.46,47.1 v14.34,46.98
  Bottom 0.61: v14.34,46.98 14.66,46.66 14.66,44.42 18.14,40.93 X9.4 20.63,40.8 23.51,40.33 41.33,22.51 59.51,22.51 62.31,19.7 62.31,15.89 69.93,8.27 72.47,8.27 73.92,9.72 AUX-1.3

### Text on the board
tNames: Y_LMT | S_DAT | Z_DIR | GND | H0- | CF- | H1- | ET1 | 5V | Z_OUT | X_LMT | 24V | H0+ | CF+ | H1+ | ET0 | TARE | B1- | Julia Pro / MKS V2.1 Daughter Board | B1+ | B0- | Z_LMT | A1- | GND | B0+ | A1+ | AUTO BED LEVEL | A0- | A0+ | SERVOS1 | CF+ | CF- | H0+ | H0- | H1+ | H1-
_tsilk: Z_LMT